# EAGLE design usb_can (EAGLE 7.4.0)
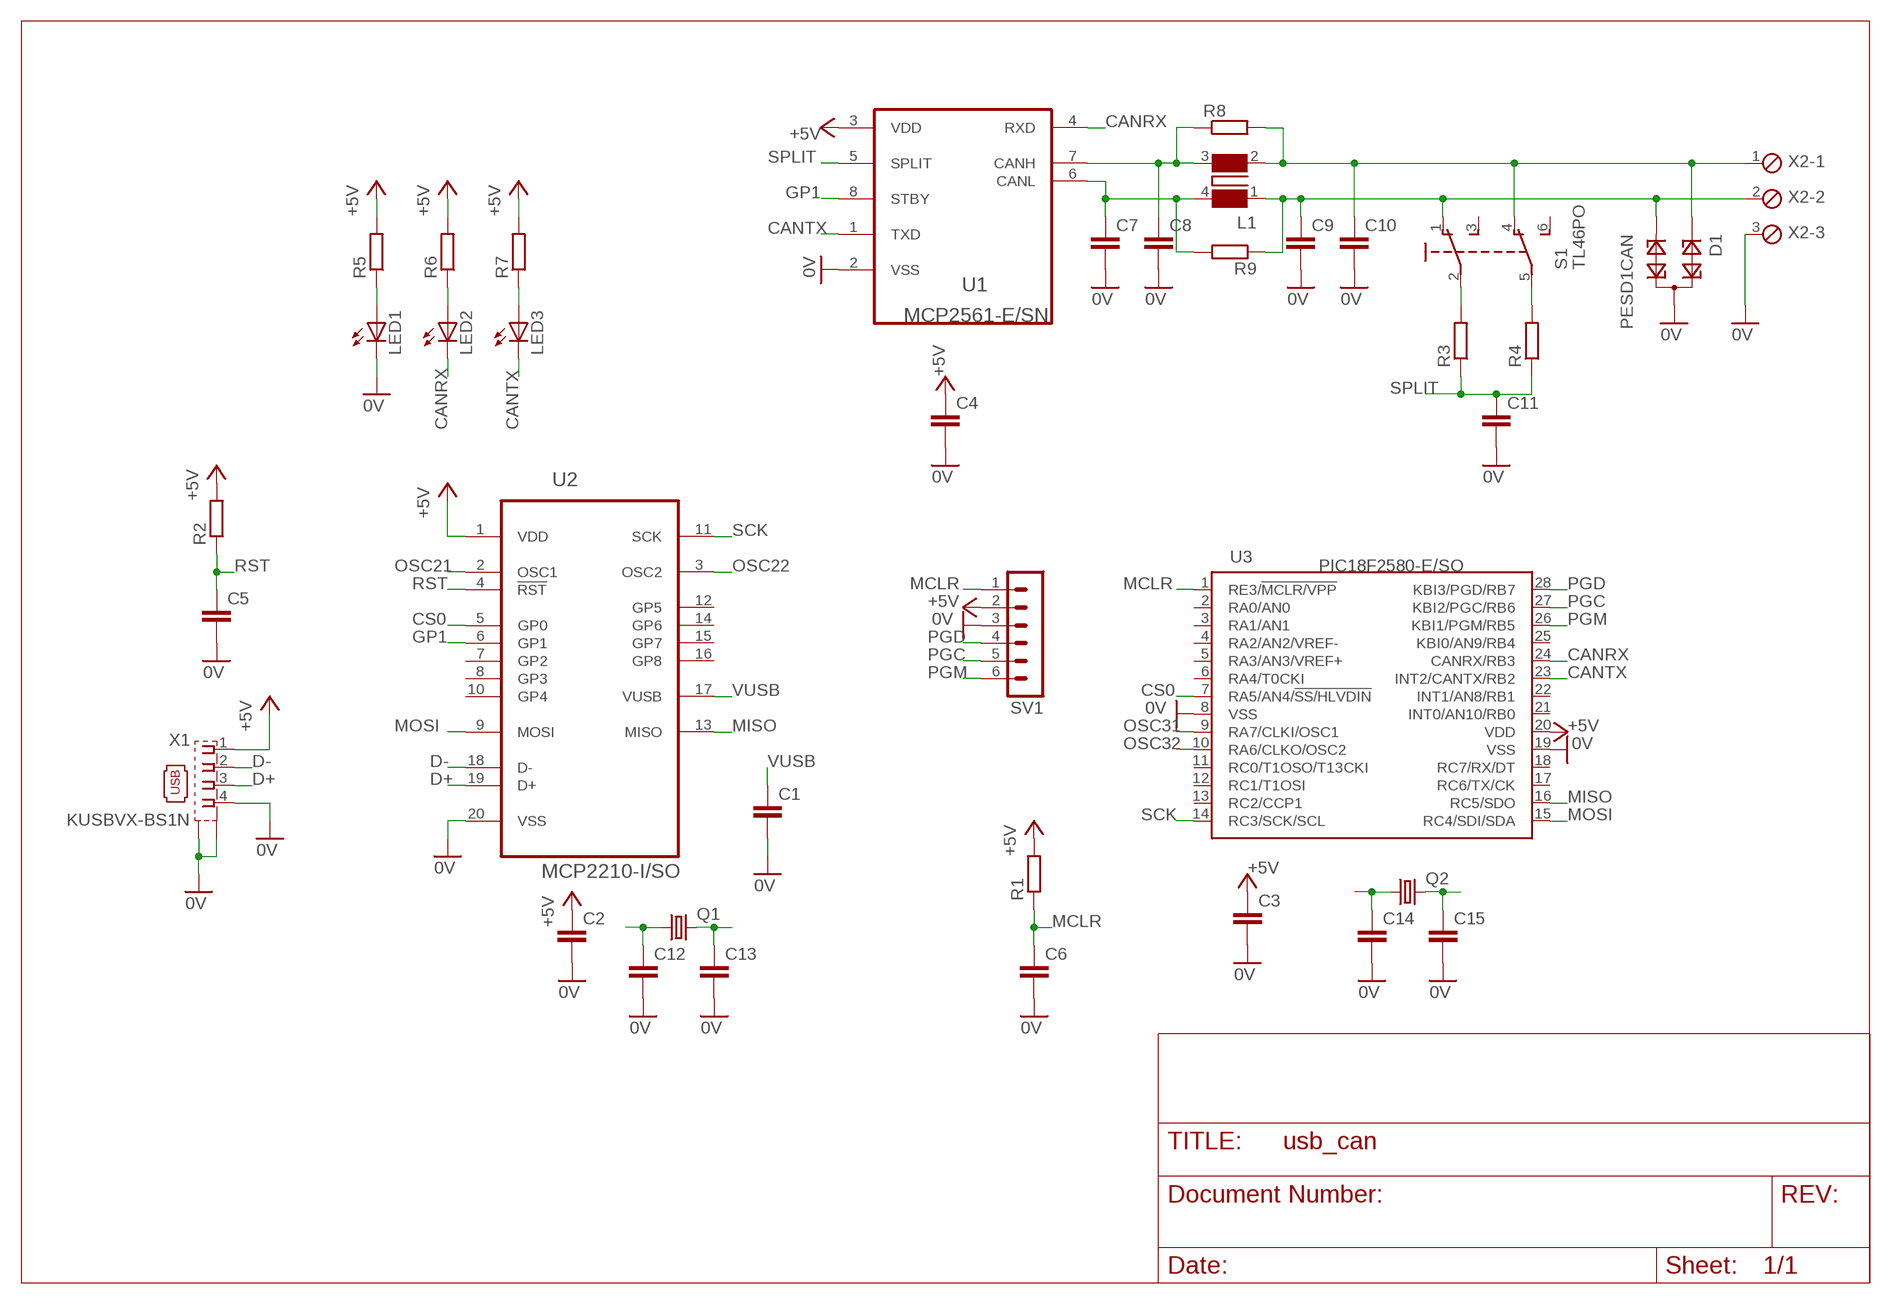
[diagram p0: schematic, sheet 1]

## Parts
C1  C-EUC1210  [C1210]
C2  C-EUC0805  [C0805]
C3  C-EUC0805  [C0805]
C4  C-EUC0805  [C0805]
C5  C-EUC0805  [C0805]
C6  C-EUC0805  [C0805]
C7  C-EUC0805  [C0805]
C8  C-EUC0805  [C0805]
C9  C-EUC0805  [C0805]
C10  C-EUC0805  [C0805]
C11  C-EUC0805  [C0805]
C12  C-EUC0805  [C0805]
C13  C-EUC0805  [C0805]
C14  C-EUC0805  [C0805]
C15  C-EUC0805  [C0805]
D1  PESD1CAN  [SOT23]
L1  WE-SLM-744242510  [WE-SLM]
LED1  LED3MM  [LED3MM]
LED2  LED3MM  [LED3MM]
LED3  LED3MM  [LED3MM]
Q1  CRYSTALHC49UP  [HC49UP]
Q2  CRYSTALHC49UP  [HC49UP]
R1  R-EU_R0805  [R0805]
R2  R-EU_R0805  [R0805]
R3  R-EU_MELF0204W  [MINI_MELF-0204W]
R4  R-EU_MELF0204W  [MINI_MELF-0204W]
R5  R-EU_R0805  [R0805]
R6  R-EU_R0805  [R0805]
R7  R-EU_R0805  [R0805]
R8  R-EU_MELF0204W  [MINI_MELF-0204W]
R9  R-EU_MELF0204W  [MINI_MELF-0204W]
S1  TL46PO  [TL4XPO]
SV1  MA06-1  [MA06-1]
U1  MCP2561-E/SN  [SOIC127P600X175-8N]
U2  MCP2210-I/SO  [SOIC127P1030X265-20N]
U3  PIC18F2580-E/SO  [SO28W]
X1  KUSBVX-BS1N  [KUSBVX-BS1N]
X2  MPT3  [3POL254]

## Nets
0V: C1.2 C2.2 C3.2 C4.2 C5.2 C6.2 C7.2 C8.2 C9.2 C10.2 C11.2 C12.2 C13.2 C14.2 C15.2 D1.3 LED1.K(C) SV1.3 U1.2(VSS) U2.20(VSS) U3.8(VSS) U3.19(VSS) X1.4 X1.M1(S1) X1.M2(S2) X2.3
+5V: C2.1 C3.1 C4.1 R1.2 R2.2 R5.2 R6.2 R7.2 SV1.2 U1.3(VDD) U2.1(VDD) U3.20(VDD) X1.1
CANRX: LED2.K(C) U1.4(RXD) U3.24(CANRX/RB3)
CANTX: LED3.K(C) U1.1(TXD) U3.23(INT2/CANTX/RB2)
CS0: U2.5(GP0) U3.7(RA5/AN4/!SS/HLVDIN)
D+: U2.19(D+) X1.3
D-: U2.18(D-) X1.2
GP1: U1.8(STBY) U2.6(GP1)
MCLR: C6.1 R1.1 SV1.1 U3.1(RE3/!MCLR/VPP)
MISO: U2.13(MISO) U3.16(RC5/SDO)
MOSI: U2.9(MOSI) U3.15(RC4/SDI/SDA)
N$1: R3.2 S1.2(P)
N$2: LED3.A R7.1
N$3: R4.2 S1.5(P1)
N$4: C8.1 L1.3 R8.1 U1.7(CANH)
N$5: C7.1 L1.4 R9.2 U1.6(CANL)
N$6: C9.1 D1.2 L1.1 R9.1 S1.1(O) X2.2
N$7: C10.1 D1.1 L1.2 R8.2 S1.4(O1) X2.1
N$8: LED2.A R6.1
N$9: LED1.A R5.1
OSC21: C12.1 Q1.1 U2.2(OSC1)
OSC22: C13.1 Q1.2 U2.3(OSC2)
OSC31: C14.1 Q2.1 U3.9(RA7/CLKI/OSC1)
OSC32: C15.1 Q2.2 U3.10(RA6/CLKO/OSC2)
PGC: SV1.5 U3.27(KBI2/PGC/RB6)
PGD: SV1.4 U3.28(KBI3/PGD/RB7)
PGM: SV1.6 U3.26(KBI1/PGM/RB5)
RST: C5.1 R2.1 U2.4(!RST)
SCK: U2.11(SCK) U3.14(RC3/SCK/SCL)
SPLIT: C11.1 R3.1 R4.1 U1.5(SPLIT)
VUSB: C1.1 U2.17(VUSB)
Unconnected: S1.3(S) S1.6(S1) U2.7(GP2) U2.8(GP3) U2.10(GP4) U2.12(GP5) U2.14(GP6) U2.15(GP7) U2.16(GP8) U3.2(RA0/AN0) U3.3(RA1/AN1) U3.4(RA2/AN2/VREF-) U3.5(RA3/AN3/VREF+) U3.6(RA4/T0CKI) U3.11(RC0/T1OSO/T13CKI) U3.12(RC1/T1OSI) U3.13(RC2/CCP1) U3.17(RC6/TX/CK) U3.18(RC7/RX/DT) U3.21(INT0/AN10/RB0) U3.22(INT1/AN8/RB1) U3.25(KBI0/AN9/RB4)

## Library data of the parts
C1-C15 = rcl:C-EU: CAPACITOR, European symbol
D1 = diode:PESD1CAN: CAN bus ESD protection diode Source: http://www.nxp.com/documents/data_sheet/PESD1CAN.pdf
L1 = WE-SLM:WE-SLM: SMD Common Mode Line Filter WE-SLM - Small size - Low Profile - High Impedance - High current capability up to 300 mA -- USB -- CAN -- Firewire -- Data Lines -- Power supply systems -- Signal Lines; MPN: 744242510; OC_FARNELL: 1636265; OC_NEWARK: 08P2555; PACKAGE: 744242; SUPPLIER: Wuerth Elektronik
LED1-LED3 = led:LED: LED OSRAM: - CHIPLED LG R971, LG N971, LY N971, LG Q971, LY Q971, LO R971, LY R971 LH N974, LH R974 LS Q976, LO Q976, LY Q976 LO Q996 - Hyper CHIPLED LW Q18S LB Q993, LB Q99A, LB R99A - SideLED LS A670, LO A670, LY A670, LG A670, LP A670 LB A673, LV A673, LT A673, LW A673 LH A674 LY A675 LS A676, LA A676, LO A676, LY A676, LW A676 LS A679, LY A679, LG A679 - Hyper Micro SIDELED® LS Y876, LA Y876, LO Y876, LY Y876 LT Y87S - SmartLED LW L88C, LW L88S LB L89C, LB L89S, LG L890 LS L89K, LO L89K, LY L89K LS L896, LA L896, LO L896, LY L896 - TOPLED LS T670, LO T670, LY T670, LG T670, LP T670 LSG T670, LSP T670, LSY T670, LOP T670, LYG T670 LG T671, LOG T671, LSG T671 LB T673, LV T673, LT T673, LW T673 LH T674 LS T676, LA T676, LO T676, LY T676, LB T676, LH T676, LSB T676, LW T676 LB T67C, LV T67C, LT T67C, LS T67K, LO T67K, LY T67K, LW E67C LS E67B, LA E67B, LO E67B, LY E67B, LB E67C, LV E67C, LT E67C LW T67C LS T679, LY T679, LG T679 LS T770, LO T770, LY T770, LG T770, LP T770 LB T773, LV T773, LT T773, LW T773 LH T774 LS E675, LA E675, LY E675, LS T675 LS T776, LA T776, LO T776, LY T776, LB T776 LHGB T686 LT T68C, LB T68C - Hyper Mini TOPLED® LB M676 - Mini TOPLED Santana® LG M470 LS M47K, LO M47K, LY M47K Source: http://www.osram.convergy.de LUXEON: - LUMILED® LXK2-PW12-R00, LXK2-PW12-S00, LXK2-PW14-U00, LXK2-PW14-V00 LXK2-PM12-R00, LXK2-PM12-S00, LXK2-PM14-U00 LXK2-PE12-Q00, LXK2-PE12-R00, LXK2-PE12-S00, LXK2-PE14-T00, LXK2-PE14-U00 LXK2-PB12-K00, LXK2-PB12-L00, LXK2-PB12-M00, LXK2-PB14-N00, LXK2-PB14-P00, LXK2-PB14-Q00 LXK2-PR12-L00, LXK2-PR12-M00, LXK2-PR14-Q00, LXK2-PR14-R00 LXK2-PD12-Q00, LXK2-PD12-R00, LXK2-PD12-S00 LXK2-PH12-R00, LXK2-PH12-S00 LXK2-PL12-P00, LXK2-PL12-Q00, LXK2-PL12-R00 Source: www.luxeon.com KINGBRIGHT: KA-3528ASYC Source: www.kingbright.com
Q1 Q2 = crystal:CRYSTAL: CRYSTAL; OC_FARNELL: unknown; OC_NEWARK: unknown
R1-R9 = rcl:R-EU_: RESISTOR, European symbol
S1 = switch:TL46PO: TINY SWITCH ON - ON Source: http://www2.produktinfo.conrad.com/datenblaetter/700000-724999/705152-da-01-de-Subminiaturschalter_TL_36YO.pdf
SV1 = con-lstb:MA06-1: PIN HEADER; OC_FARNELL: unknown; OC_NEWARK: unknown
U1 = Microchip-MCP2561-E_SN:MCP2561-E/SN: High-Speed CAN Transceiver,SOIC-8; MPN: MCP2561-E/SN; OC_FARNELL: 2362837; OC_NEWARK: 12X8698; PACKAGE: SOIC-8; SUPPLIER: Microchip
U2 = microchip:MCP2210-I/SO: USB-to-SPI Protocol Converter,SOIC-20; MPN: MCP2210-I/SO; OC_FARNELL: 2078574; OC_NEWARK: 83T7176; PACKAGE: SOIC-20; SUPPLIER: MICROCHIP
U3 = microchip:PIC18F2*80: 28-Pin Enhanced Flash Microcontrollers with ECAN(TM) Technology 10-Bit A/D and nanoWatt Technology Source: http://www.microchip.com .. 39637a.pdf; MF: MICROCHIP; MPN: PIC18F2580-I/SO; OC_FARNELL: 9321284; OC_NEWARK: 71J7243
X1 = con-kycon:KUSBVX-BS1N: USB B-type Receptacle Vertical, 4 Position, Through Hole Source: Sibalco Kycon KUSBVX-BS1N-xxx.pdf
X2 = con-phoenix-254:MPT3: PHOENIX CONNECTOR; OC_FARNELL: unknown; OC_NEWARK: unknown

## Board
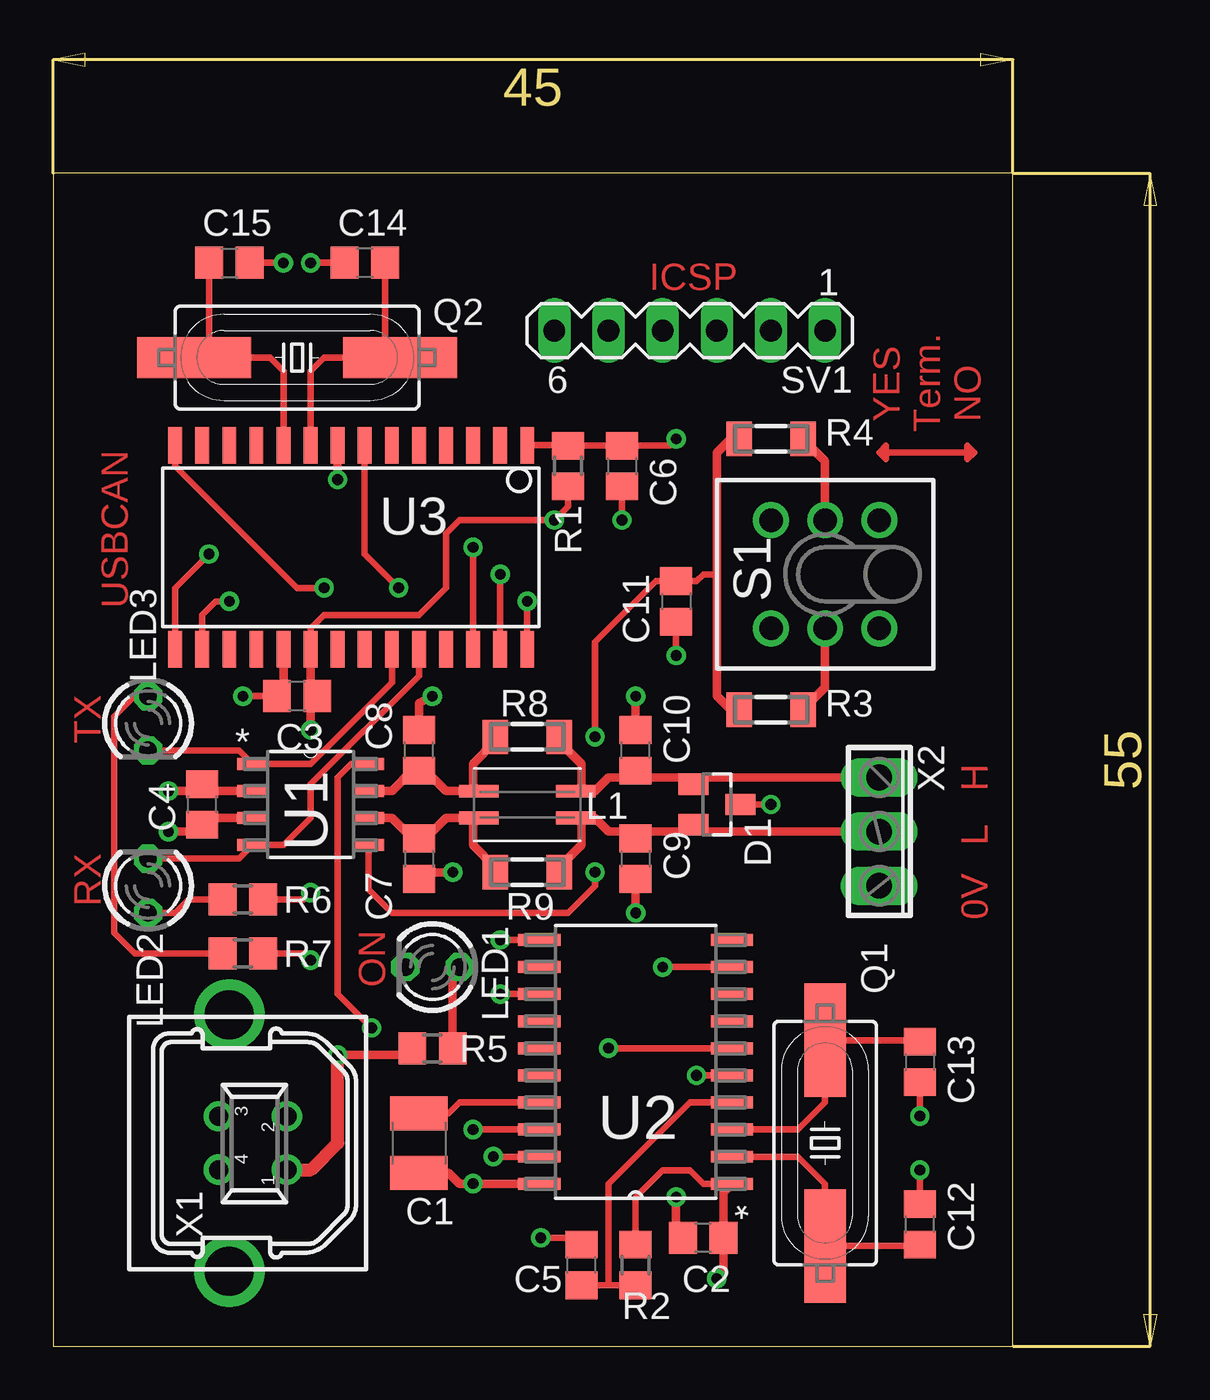
[diagram p1: board, top side]
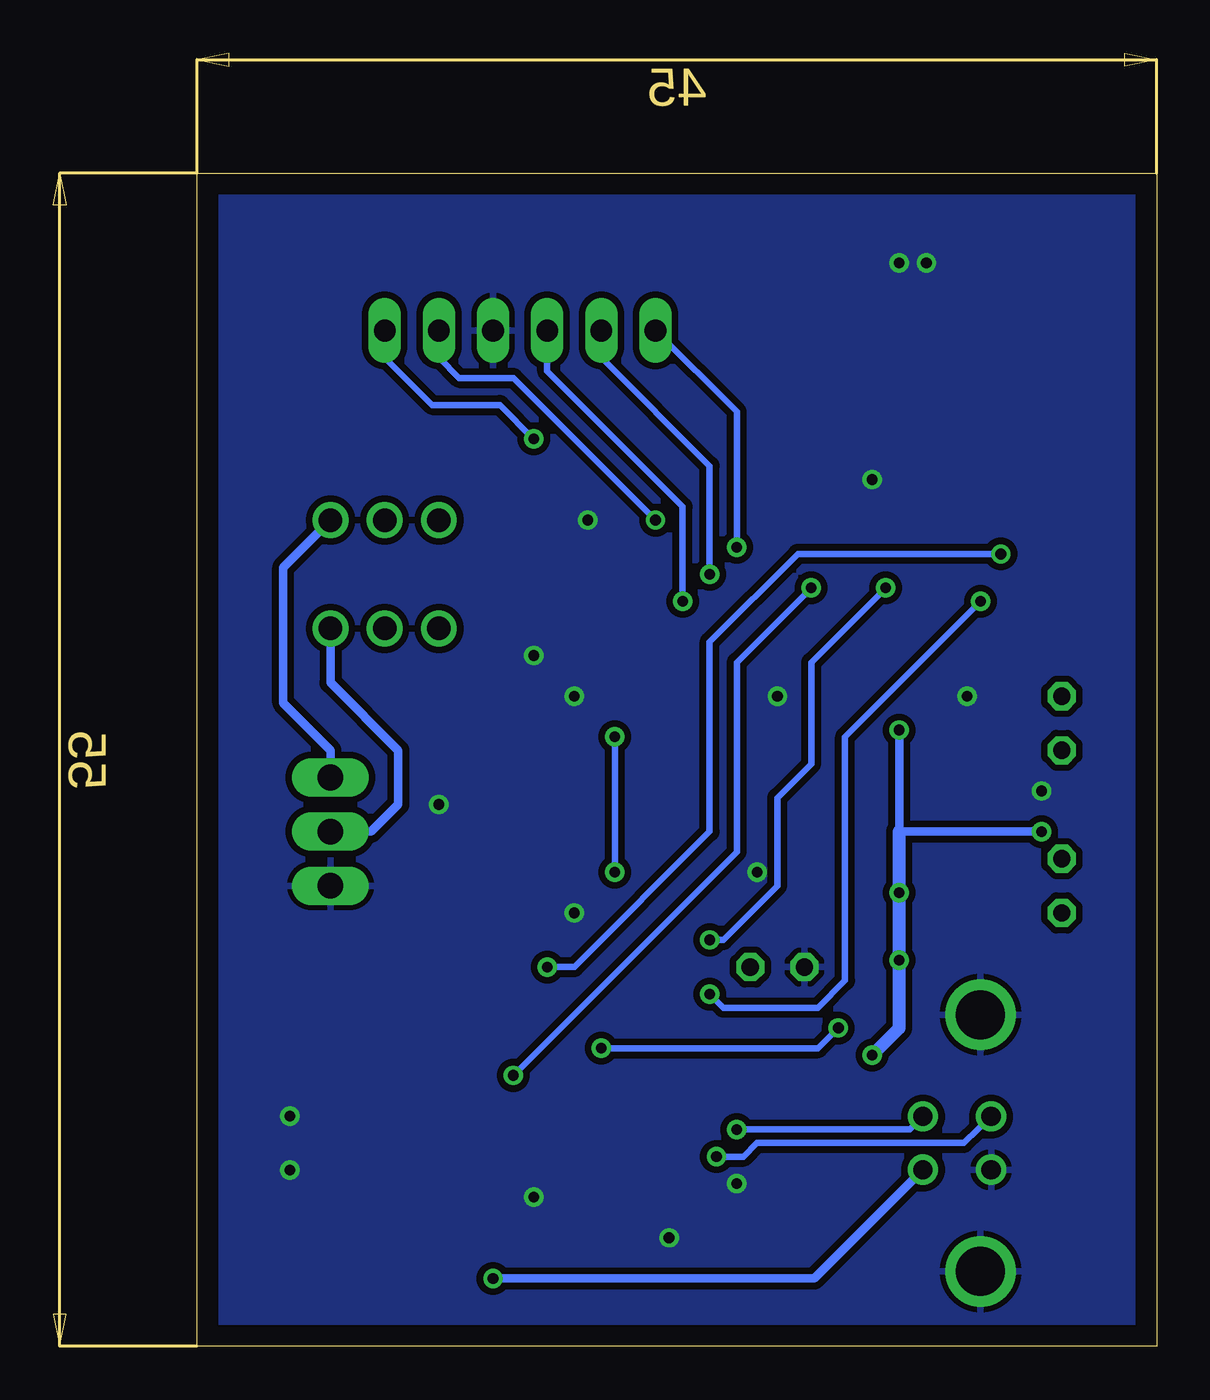
[diagram p2: board, bottom side, seen from below]

Size 45 x 55 mm. Coordinates in mm from the lower left corner, seen from the top.
Outline: 0,0 45,0 45,55 0,55 0,0
Copper layers (1*16): Top 0.035mm / dielectric 1.5mm / Bottom 0.035mm
Design rules "default *": minimum track width 0.31mm, minimum drill 0.5mm, track to track 0.31mm, track to pad 0.31mm, pad to pad 0.31mm, via to via 0.31mm, smd to smd 8mil, copper to edge 1mm, drill to drill 0.31mm, minimum pad ring 10mil, minimum via ring 8mil, stop-mask expansion 4mil, vias tented up to drill 0mil, thermal gap 10mil

### Footprints (pad centres in the part's own frame; a part is rotated, then mirrored left to right if it is on the bottom)
C1210 = smd 1.6 x 2.7: 1 -1.4,0; 2 1.4,0
C0805 = smd 1.3 x 1.5: 1 -0.95,0; 2 0.95,0
SOT23 = smd 1 x 1.4: 1 -0.95,-1.1; 2 0.95,-1.1; 3 0,1.1
WE-SLM = smd 1.85 x 0.6: 1 -2.28,0.63; 2 -2.28,-0.62; 3 2.27,-0.62; 4 2.27,0.63
LED3MM = drill 0.813 octagon: A -1.27,0; K 1.27,0
HC49UP = smd 5.334 x 1.93: 1 -4.826,0; 2 4.826,0
R0805 = smd 1.3 x 1.5: 1 -0.95,0; 2 0.95,0
MINI_MELF-0204W = smd 1.2 x 1.6: 1 -1.5,0; 2 1.5,0
TL4XPO = drill 1.1 pad 1.676: 1 -2.54,2.54; 2 0,2.54; 3 2.54,2.54; 4 -2.54,-2.54; 5 0,-2.54; 6 2.54,-2.54
MA06-1 = drill 1.016 long: 1 -6.35,0; 2 -3.81,0; 3 -1.27,0; 4 1.27,0; 5 3.81,0; 6 6.35,0
SOIC127P600X175-8N = smd 1.473 x 0.559: 1 -2.718,1.905; 2 -2.718,0.635; 3 -2.718,-0.635; 4 -2.718,-1.905; 5 2.718,-1.905; 6 2.718,-0.635; 7 2.718,0.635; 8 2.718,1.905
SOIC127P1030X265-20N = smd 1.981 x 0.559: 1 -4.521,5.715; 2 -4.521,4.445; 3 -4.521,3.175; 4 -4.521,1.905; 5 -4.521,0.635; 6 -4.521,-0.635; 7 -4.521,-1.905; 8 -4.521,-3.175; 9 -4.521,-4.445; 10 -4.521,-5.715; 11 4.521,-5.715; 12 4.521,-4.445; 13 4.521,-3.175; 14 4.521,-1.905; 15 4.521,-0.635; 16 4.521,0.635; 17 4.521,1.905; 18 4.521,3.175; 19 4.521,4.445; 20 4.521,5.715
SO28W = smd 0.65 x 1.7: 1 -7.62,-4.78; 2 -6.35,-4.78; 3 -5.08,-4.78; 4 -3.81,-4.78; 5 -2.54,-4.78; 6 -1.27,-4.78; 7 0,-4.78; 8 1.27,-4.78; 9 2.54,-4.78; 10 3.81,-4.78; 11 5.08,-4.78; 12 6.35,-4.78; 13 7.62,-4.78; 14 8.89,-4.78; 15 8.89,4.78; 16 7.62,4.78; 17 6.35,4.78; 18 5.08,4.78; 19 3.81,4.78; 20 2.54,4.78; 21 1.27,4.78; 22 0,4.78; 23 -1.27,4.78; 24 -2.54,4.78; 25 -3.81,4.78; 26 -5.08,4.78; 27 -6.35,4.78; 28 -7.62,4.78
KUSBVX-BS1N = drill 0.9 pad 1.422: 1 1.25,2.7; 2 -1.25,2.7; 3 -1.25,-0.5; 4 1.25,-0.5 | drill 2.3 pad 2.7: M1 -6.02,0; M2 6.02,0
3POL254 = drill 1.2 long: 1 -2.54,0; 2 0,0; 3 2.54,0

### Placement (x,y rotation side)
C1  17.14,9.53 270 top
C2  30.48,5.08 180 top
C3  11.43,30.48 180 top
C4  6.99,25.4 90 top
C5  24.77,3.81 90 top
C6  26.67,41.27 270 top
C7  17.14,22.86 270 top
C8  17.14,27.94 90 top
C9  27.3,22.86 270 top
C10  27.3,27.94 90 top
C11  29.21,34.92 270 top
C12  40.64,5.71 90 top
C13  40.64,13.34 270 top
C14  14.61,50.8 180 top
C15  8.26,50.8 0 top
D1  31.11,25.4 270 top
L1  22.23,25.4 180 top
LED1  17.78,17.78 180 top
LED2  4.45,21.59 90 top
LED3  4.45,29.21 270 top
Q1  36.2,9.53 90 top
Q2  11.43,46.35 180 top
R1  24.13,41.27 270 top
R2  27.3,3.81 90 top
R3  33.66,29.84 0 top
R4  33.66,42.55 0 top
R5  17.78,13.97 180 top
R6  8.89,20.95 0 top
R7  8.89,18.41 0 top
R8  22.23,28.57 0 top
R9  22.23,22.23 180 top
S1  36.2,36.2 180 top
SV1  29.84,47.62 180 top
U1  12.06,25.4 0 top
U2  27.3,13.34 180 top
U3  14.61,37.47 180 top
X1  8.26,9.53 270 top
X2  38.73,24.13 270 top

### Tracks (layer width: path | path; a pad name or v marks a point on that pad's centre or on a via)
0V  (via drill 0.5)
  Top 0.31: 22.86,7.54 U2.20 | C13.2 v40.64,10.79 | C12.2 v40.64,8.26 | C3.2 v8.89,30.48 | C15.2 v10.79,50.8 | C14.2 v12.06,50.8 | C11.2 v29.21,32.38 | C6.2 v26.67,38.73 | D1.3 v33.66,25.4 | C5.2 24.45,5.08 v22.86,5.08
  Top 0.406: C1.2 18.55,8.12 19.05,7.62 v19.68,7.62 U2.20 | C10.2 v27.3,30.48 | C9.2 v27.3,20.32 | 17.46,28.57 C8.2 17.14,30.16 v17.78,30.48 | C7.2 17.46,22.23 v18.73,22.23 | U3.8 v13.34,40.64 | C2.2 29.21,5.4 v29.21,6.99 | U1.2 7.3,26.04 C4.2 6.67,26.04 v5.4,26.04 | U3.19 10.79,30.8 C3.2
  pour Bottom: 0,55 45,55 45,0 0,0
+5V  (via drill 0.5)
  Top 0.31: R1.2 24.13,39.37 v23.5,38.73 19.05,38.73 18.41,38.1 18.41,35.56 17.14,34.29 12.7,34.29 12.06,33.66 U3.20 | R2.2 27.3,6.99 28.57,8.26 29.84,8.26 30.48,7.62 U2.1 | R6.2 11.75,20.95 v12.06,21.27 | R7.2 11.75,18.41 v12.06,18.1
  Top 0.406: R5.2 16.51,13.65 v13.34,13.65 | U2.1 31.43,7.22 C2.1 31.43,3.49 v31.11,3.17 | U1.3 7.3,24.77 C4.1 6.67,24.13 v5.4,24.13 | U3.20 12.06,30.8 C3.1 12.06,30.16 v12.06,28.89
  Top 0.61: X1.1 12.09,8.28 13.34,9.53 v13.34,13.65
  Bottom 0.31: SV1.2 33.66,46.35 32.7,45.4 30.16,45.4 v23.5,38.73
  Bottom 0.406: v31.11,3.17 16.05,3.17 X1.1 | v12.06,28.89 12.06,24.13 v5.4,24.13
  Bottom 0.61: v13.34,13.65 12.06,14.92 v12.06,18.1 v12.06,21.27 12.06,24.13
CANRX
  Top 0.31: U3.24 17.14,31.43 12.06,26.35 12.06,24.77 10.79,23.5 U1.4 8.71,22.86 LED2.K
CANTX
  Top 0.31: U3.23 15.88,31.11 12.06,27.3 U1.1 8.71,27.94 LED3.K
CS0  (via drill 0.5)
  Top 0.31: v30.16,12.7 U2.5 | U3.7 14.61,37.15 v16.19,35.56
  Bottom 0.31: v30.16,12.7 19.68,23.18 19.68,32.07 v16.19,35.56
D+  (via drill 0.5)
  Top 0.31: U2.19 v20.64,8.89
  Bottom 0.31: v20.64,8.89 19.37,8.89 18.73,9.53 9.04,9.53 X1.3
D-  (via drill 0.5)
  Top 0.31: U2.18 v19.68,10.16
  Bottom 0.31: v19.68,10.16 11.57,10.16 X1.2
GP1  (via drill 0.5)
  Top 0.31: U2.6 v26.04,13.97 | v14.92,14.92 13.34,16.51 13.34,26.67 13.97,27.3 U1.8
  Bottom 0.31: v26.04,13.97 15.88,13.97 v14.92,14.92
MCLR  (via drill 0.5)
  Top 0.31: U3.1 24.11,42.24 C6.1 | C6.1 R1.1 | v29.21,42.55 28.89,42.23 C6.1
  Bottom 0.31: SV1.1 36.2,46.35 33.97,44.13 30.8,44.13 v29.21,42.55
MISO  (via drill 0.5)
  Top 0.31: U2.13 v20.95,16.51 | v8.26,34.92 7.62,34.92 6.99,34.29 U3.16
  Bottom 0.31: v8.26,34.92 14.61,28.57 14.61,17.14 15.88,15.88 20.32,15.88 v20.95,16.51
MOSI  (via drill 0.5)
  Top 0.31: U2.9 v28.57,17.78 | v7.3,37.15 5.71,35.56 U3.15
  Bottom 0.31: v7.3,37.15 16.83,37.15 20.95,33.02 20.95,24.13 27.3,17.78 v28.57,17.78
N$1
  Top 0.406: S1.2 36.2,30.89 R3.2
N$2
  Top 0.31: R7.1 3.81,18.41 2.86,19.37 2.86,29.53 3.81,30.48 LED3.A
N$3
  Top 0.406: S1.5 36.2,41.51 R4.2
N$4
  Top 0.406: R8.1 20.73,28.34 19.68,27.3 19.68,26.29 L1.3 19.94,26.04 18.41,26.04 17.46,26.99 C8.1 16.83,26.99 15.88,26.04 U1.7
N$5
  Top 0.406: R9.2 20.73,22.45 19.68,23.5 19.68,24.5 L1.4 18.41,24.77 17.46,23.81 C7.1 16.82,24.13 16.51,24.13 15.88,24.77 U1.6
N$6
  Top 0.406: X2.2 29.84,24.13 | 29.84,24.13 27.62,24.13 C9.1 26.99,24.13 26.04,24.13 25.39,24.77 L1.1 24.77,24.51 24.77,23.5 23.73,22.45 R9.1 | D1.2 30.02,24.3 29.84,24.13
  Bottom 0.406: S1.1 38.73,31.11 35.56,27.94 35.56,25.4 36.83,24.13 X2.2
N$7
  Top 0.406: X2.1 29.84,26.67 | 29.84,26.67 27.62,26.67 C10.1 26.98,26.67 26.04,26.67 25.39,26.02 L1.2 24.77,26.28 24.77,27.3 23.73,28.34 R8.2 | D1.1 30.02,26.5 29.84,26.67
  Bottom 0.406: X2.1 38.73,27.94 40.96,30.16 40.96,36.51 S1.4
N$8
  Top 0.31: LED2.A 5.71,20.32 6.35,20.95 R6.1
N$9
  Top 0.406: R5.1 18.73,17.46 LED1.A
N$10
  Top 0.31: 38.73,41.91 43.18,41.91 | 43.18,41.91 42.86,42.23 42.86,41.59 43.18,41.91 | 38.73,41.91 39.05,42.23 39.05,41.59 38.73,41.91
OSC21
  Top 0.31: U2.2 34.92,8.89 36.2,7.62 Q1.1 40.57,4.7 C12.1
OSC22
  Top 0.31: U2.3 34.92,10.16 36.2,11.43 Q1.2 40.57,14.35 C13.1
OSC31
  Top 0.31: U3.9 12.06,45.72 12.7,46.35 Q2.1 15.55,47.06 C14.1
OSC32
  Top 0.31: U3.10 10.79,45.72 10.16,46.35 Q2.2 7.3,47.06 C15.1
PGC  (via drill 0.5)
  Top 0.31: U3.27 v20.95,36.2
  Bottom 0.31: v20.95,36.2 20.95,41.27 26.04,46.35 SV1.5
PGD  (via drill 0.5)
  Top 0.31: U3.28 v22.23,34.92
  Bottom 0.31: v22.23,34.92 22.23,39.37 28.57,45.72 SV1.4
PGM  (via drill 0.5)
  Top 0.31: U3.26 v19.68,37.47
  Bottom 0.31: v19.68,37.47 19.68,43.81 SV1.6
RST
  Top 0.31: U2.4 29.84,11.43 26.04,7.62 26.04,2.86 | C5.1 26.04,2.86 | 26.04,2.86 R2.1
SCK  (via drill 0.5)
  Top 0.31: U3.14 5.71,41.27 11.43,35.56 v12.7,35.56 | 22.86,19.13 U2.11 v20.95,19.05
  Bottom 0.31: v20.95,19.05 20.32,19.05 17.78,21.59 17.78,25.72 16.19,27.3 16.19,32.07 v12.7,35.56
SPLIT  (via drill 0.5)
  Top 0.31: 31.11,36.2 30.48,36.2 30.16,35.88 C11.1 28.25,35.88 25.4,33.02 v25.4,28.57 | U1.5 14.78,21.41 15.88,20.32 24.13,20.32 25.4,21.59 v25.4,22.23
  Top 0.406: R3.1 31.75,29.84 31.11,30.48 31.11,36.2 31.11,41.91 31.75,42.55 R4.1
  Bottom 0.31: v25.4,22.23 v25.4,28.57
VUSB
  Top 0.31: C1.1 18.55,10.93 19.05,11.43 U2.17

### Text on the board
Top: ICSP | YES / Term. / NO | USBCAN | TX | H | L | RX | 0V | ON